# Altium schematic sheet Power_official.SchDoc
size A4; Organization: Altium Limited; Address1: L3, 12a Rodborough Rd; Address2: Frenchs Forest; Address3: NSW; Address4: Australia 2086
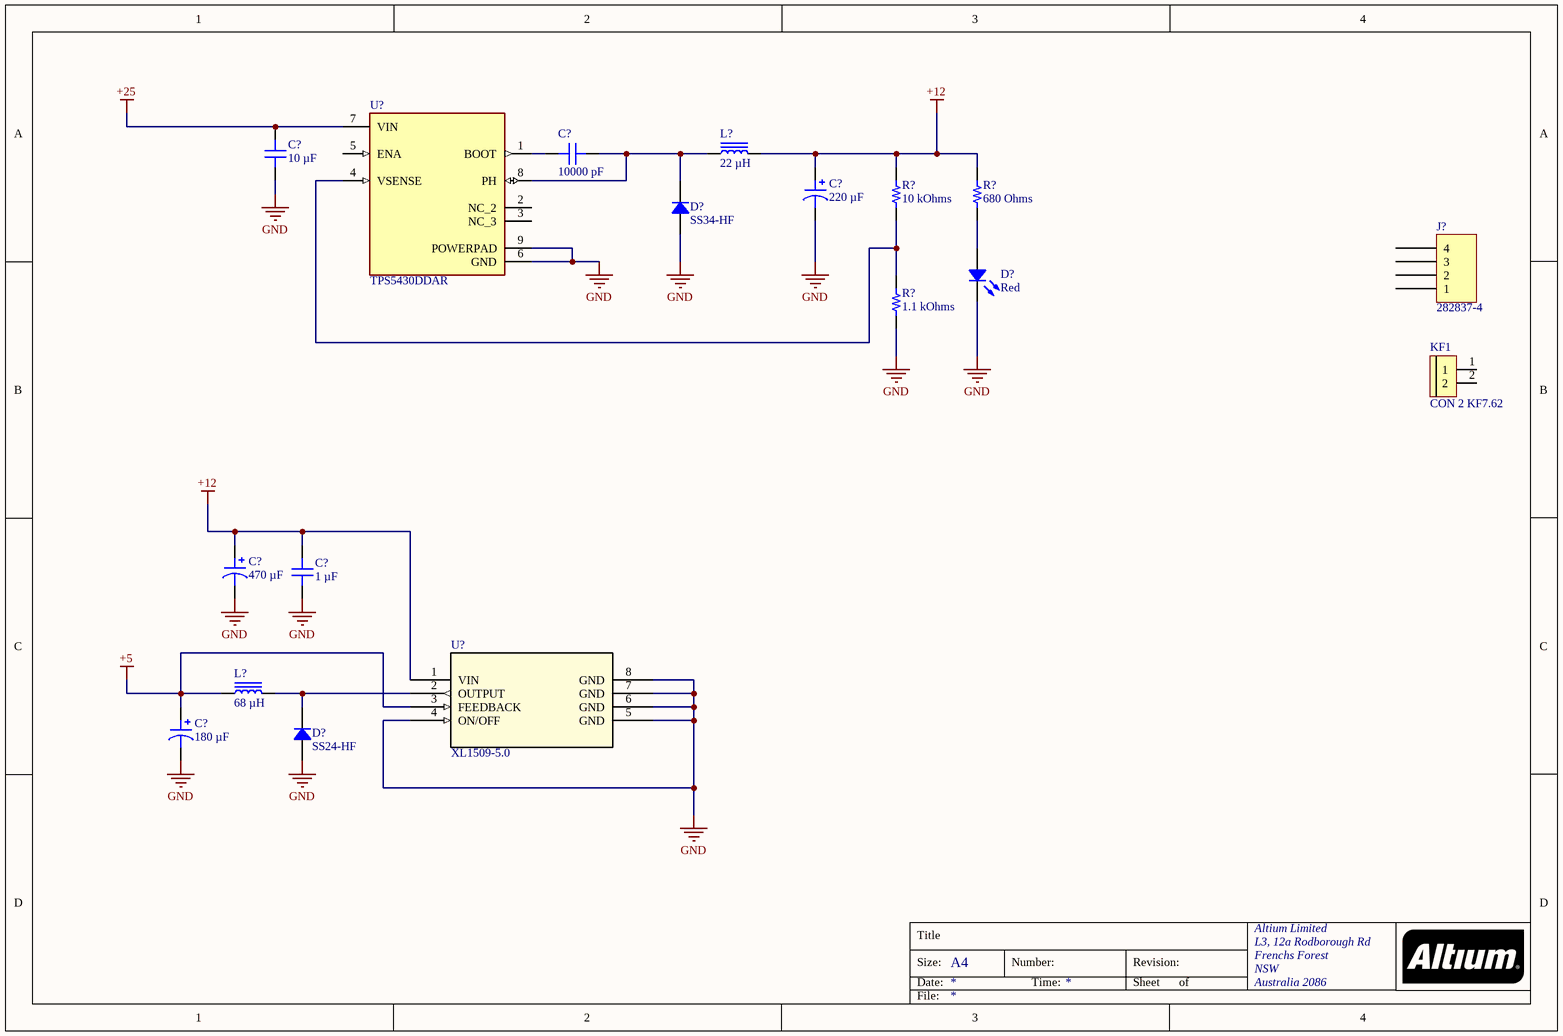
[diagram p0: Power_official.SchDoc]

## Parts
(Parts that share a designator on the sheet are numbered #1, #2 ... from top to bottom, then left to right.)
C?#1  10 µF  [CAP 1206_3216 - 0.8MM]
C?#2  10000 pF  [CAP 0603_1608]
C?#3  220 µF  [CAP ALSMD 6.6MM H6.1MM]
C?#4  470 µF  [CAP ALSMD 8.3MM H10.5MM]
C?#5  1 µF  [CAP 0805_2012]
C?#6  180 µF  [CAP ALSMD 6.6MM H8.0MM]
D?#1  SS34-HF  [DO214AC SMA]
D?#2  Red  [LED 0805_2012 RED]
D?#3  SS24-HF  [DO214AC SMA]
J?  282837-4  [TE 282837-4]
KF1  CON 2 KF7.62  [CON 2 KF7.62]
L?#1  22 µH  [WURTH WE-PD 1260]
L?#2  68 µH  [TDK SLF10145]
R?#1  10 kOhms  [RES 0805_2012]
R?#2  680 Ohms  [RES 0805_2012]
R?#3  1.1 kOhms  [RES 0805_2012]
U?#1  TPS5430DDAR  [CONV_TPS5430DDAR]
U?#2  XL1509-5.0  [SOP8SOIC-8_UMW]

## Nets
+5: C?#6.1 L?#2.1 U?#2.3(FEEDBACK)
+12: C?#3.1 C?#4.1 C?#5.2 L?#1.2 R?#1.2 R?#2.2 U?#2.1(VIN)
+25: C?#1.2 U?#1.7(VIN)
GND: C?#1.1 C?#3.2 C?#4.2 C?#5.1 C?#6.2 D?#1.1 D?#2.2 D?#3.1 R?#3.1 U?#1.6(GND) U?#1.9(POWERPAD) U?#2.4(ON/OFF) U?#2.5(GND) U?#2.6(GND) U?#2.7(GND) U?#2.8(GND)
NetC?#2_1: C?#2.1 U?#1.1(BOOT)
NetC?#2_2: C?#2.2 D?#1.2 L?#1.1 U?#1.8(PH)
NetD?#2_1: D?#2.1 R?#2.1
NetD?#3_2: D?#3.2 L?#2.2 U?#2.2(OUTPUT)
NetR?#1_1: R?#1.1 R?#3.2 U?#1.4(VSENSE)

Not connected (* = marked no-connect by the designer): J? 1 2 3 4; KF1 1 2; U?#1 2(NC_2) 3(NC_3) 5(ENA)

## Notes on the sheet
- Title
- Size:
- Date:
- A4
- Number:
- Time:
- Revision:
- Sheet
- of
- File:

## Library data of the parts
C?#1 = 885012108022: CAP CER 10UF 50V X5R 1206; manufacturer: Würth Elektronik; Tolerance: ±10%; Part Number: 885012108022; Value: 10 µF; Applications: General Purpose; Capacitance: 10 µF; componentlink1description: Datasheet; componentlink1url: https://www.we-online.com/catalog/datasheet/885012108022.pdf; componentlink2description: DigiKey Link; componentlink2url: https://www.digikey.com/en/products/detail/würth-elektronik/885012108022/17829827; Device Package: 1206 (3216 Metric); lastupdated: 6/4/2024 7:10:08 PM; Lifecycle Status: Active; Minimum Order: 1; Mounting Type: Surface Mount, MLCC; Operating Temperature: -55°C ~ 85°C; Package / Case: 1206 (3216 Metric); packaging: TapeAndReel; partid: 49462; Part Status: Active; price: 1.51; series: WCAP-CSGP; Size / Dimension: 0.126" L x 0.063" W (3.20mm x 1.60mm); Supplier 1: DigiKey; Supplier Part Number 1: 732-885012108022CT-ND; Temperature Coefficient: X5R; Thickness (Max): 0.071" (1.80mm); Voltage - Rated: 50V
C?#2 = C0603C103K4REC7867: CAP CER 0603 10NF 16V X7R 10%; manufacturer: KEMET; Part Number: C0603C103K4REC7867; Value: 10000 pF; Applications: ESD Protection; Capacitance: 10000 pF; componentlink1description: Datasheet; componentlink1url: https://api.kemet.com/component-edge/download/datasheet/C0603C103K4REC7867.pdf; componentlink2description: DigiKey Link; componentlink2url: https://www.digikey.com/en/products/detail/kemet/C0603C103K4REC7867/8643658; Device Package: 0603 (1608 Metric); lastupdated: 2/9/2024 8:09:56 PM; Lifecycle Status: Active; Minimum Order: 1; Mounting Type: Surface Mount, MLCC; Operating Temperature: -55°C ~ 125°C; Package / Case: 0603 (1608 Metric); packaging: TapeAndReel; partid: 34998; Part Status: Active; price: 0.01; series: ESD SMD Comm X7R; Size / Dimension: 0.063" L x 0.031" W (1.60mm x 0.80mm); Supplier 1: DigiKey; Supplier Part Number 1: 399-C0603C103K4REC7867CT-ND; Temperature Coefficient: X7R; Thickness (Max): 0.034" (0.87mm); Tolerance: ±10%; Voltage - Rated: 16V
C?#3 = EEE-FT1C221AL: CAP ALUM 220UF 20% 16V SMD; manufacturer: Panasonic Electronic Components; ESR (Equivalent Series Resistance): 260mOhm @ 100kHz; Lifetime @ Temp.: 2000 Hrs @ 105°C; Polarization: Polar; Ripple Current @ High Frequency: 300 mA @ 100 kHz; Ripple Current @ Low Frequency: 195 mA @ 120 Hz; Surface Mount Land Size: 0.260" L x 0.260" W (6.60mm x 6.60mm); Part Number: EEE-FT1C221AL; Applications: Automotive; Capacitance: 220 µF; componentlink1description: Datasheet; componentlink1url: https://na.industrial.panasonic.com/file-download/19625; componentlink2description: DigiKey Link; componentlink2url: https://www.digikey.com/en/products/detail/panasonic-electronic-components/EEE-FT1C221AL/12459640; Height - Seated (Max): 0.240" (6.10mm); lastupdated: 6/3/2024 8:16:06 PM; Lifecycle Status: Active; Minimum Order: 1; Mounting Type: Surface Mount; Operating Temperature: -55°C ~ 105°C; packaging: TapeAndReel; partid: 28448; price: 0.16; Ratings: AEC-Q200; series: FT, Halogen Free; Size / Dimension: 0.248" Dia (6.30mm); Supplier 1: DigiKey; Supplier Part Number 1: 10-EEE-FT1C221ALCT-ND; Tolerance: ±20%; value: 220 µF; Voltage - Rated: 16 V
C?#4 = EMZS350ARA471MHA0G: CAP ALUM 470UF 20% 35V SMD; manufacturer: United Chemi-Con; ESR (Equivalent Series Resistance): 80mOhm @ 100kHz; Lifetime @ Temp.: 2000 Hrs @ 105°C; Polarization: Polar; Ripple Current @ High Frequency: 850 mA @ 100 kHz; Ripple Current @ Low Frequency: 425 mA @ 120 Hz; Surface Mount Land Size: 0.327" L x 0.327" W (8.30mm x 8.30mm); Part Number: EMZS350ARA471MHA0G; Applications: Automotive; Capacitance: 470 µF; componentlink1description: Datasheet; componentlink1url: //media.digikey.com/pdf/Data%20Sheets/United%20Chemi-Con%20PDFs/MZS_Series_NPI.pdf; componentlink2description: DigiKey Link; componentlink2url: https://www.digikey.com/en/products/detail/united-chemi-con/EMZS350ARA471MHA0G/8637079; Device Package: Radial, Can - SMD; Height - Seated (Max): 0.413" (10.50mm); lastupdated: 6/3/2024 8:15:48 PM; Lifecycle Status: Active; Minimum Order: 1; Mounting Type: Surface Mount; Operating Temperature: -55°C ~ 105°C; Package / Case: Radial, Can - SMD; packaging: TapeAndReel; partid: 7526; Part Status: Active; price: 0.40; Ratings: AEC-Q200; series: Alchip™- MZS; Size / Dimension: 0.315" Dia (8.00mm); Supplier 1: DigiKey; Supplier Part Number 1: 565-5123-1-ND; Tolerance: ±20%; value: 470 µF; Voltage - Rated: 35 V
C?#5 = C0805C105J4RECAUTO: CAP CER 0805 1UF 16V X7R 5%; manufacturer: KEMET; Part Number: C0805C105J4RECAUTO; Value: 1 µF; Applications: Automotive, ESD Protection; Capacitance: 1 µF; componentlink1description: Datasheet; componentlink1url: https://api.kemet.com/component-edge/download/datasheet/C0805C105J4RECAUTO.pdf; componentlink2description: DigiKey Link; componentlink2url: https://www.digikey.com/en/products/detail/kemet/C0805C105J4RECAUTO/8646570; Device Package: 0805 (2012 Metric); lastupdated: 2/9/2024 8:15:08 PM; Lifecycle Status: Active; Minimum Order: 1; Mounting Type: Surface Mount, MLCC; Operating Temperature: -55°C ~ 125°C; Package / Case: 0805 (2012 Metric); packaging: TapeAndReel; partid: 32406; Part Status: Active; price: 0.05; Ratings: AEC-Q200; series: ESD SMD Auto X7R; Size / Dimension: 0.079" L x 0.049" W (2.00mm x 1.25mm); Supplier 1: DigiKey; Supplier Part Number 1: 399-C0805C105J4RECAUTOCT-ND; Temperature Coefficient: X7R; Thickness (Max): 0.055" (1.40mm); Tolerance: ±5%; Voltage - Rated: 16V
C?#6 = EEE-FKE181XSP: CAP ALUM 180UF 20% 25V SMD; manufacturer: Panasonic Electronic Components; ESR (Equivalent Series Resistance): 340mOhm @ 100kHz; Lifetime @ Temp.: 2000 Hrs @ 105°C; Polarization: Polar; Ripple Current @ High Frequency: 280 mA @ 100 kHz; Ripple Current @ Low Frequency: 182 mA @ 120 Hz; Surface Mount Land Size: 0.260" L x 0.260" W (6.60mm x 6.60mm); Part Number: EEE-FKE181XSP; Applications: Automotive; Capacitance: 180 µF; componentlink1description: Datasheet; componentlink1url: https://b2b-api.panasonic.eu/file_stream/pids/fileversion/3102; componentlink2description: DigiKey Link; componentlink2url: https://www.digikey.com/en/products/detail/panasonic-electronic-components/EEE-FKE181XSP/5805038; Device Package: Radial, Can - SMD; Height - Seated (Max): 0.315" (8.00mm); lastupdated: 6/3/2024 8:16:27 PM; Lifecycle Status: Active; Minimum Order: 1; Mounting Type: Surface Mount; Operating Temperature: -55°C ~ 105°C; Package / Case: Radial, Can - SMD; packaging: TapeAndReel; partid: 27654; Part Status: Active; price: 0.22; Ratings: AEC-Q200; series: FKS; Size / Dimension: 0.248" Dia (6.30mm); Supplier 1: DigiKey; Supplier Part Number 1: P18956CT-ND; Tolerance: ±20%; value: 180 µF; Voltage - Rated: 25 V
D?#1 = SS34-HF: DIODE SCHOTTKY 40V 3A DO214AC; Manufacturer: Comchip Technology; Capacitance @ Vr, F: 450pF @ 4V, 1MHz; Current - Reverse Leakage @ Vr: 500 µA @ 40 V; Speed: Fast Recovery =< 500ns, > 200mA (Io); Voltage - Forward (Vf) (Max) @ If: 550 mV @ 3 A; Part Number: SS34-HF; ComponentLink1Description: Datasheet; ComponentLink1URL: http://www.comchiptech.com/admin/files/product/20190514101641.pdf; ComponentLink2Description: DigiKey Link; ComponentLink2URL: https://www.digikey.com/en/products/detail/comchip-technology/SS34-HF/10279693; Current - Average Rectified (Io): 3A; Diode Type: Schottky; LastUpdated: 6/3/2024 7:54:30 PM; Lifecycle Status: Active; Minimum Order: 1; Mounting Type: Surface Mount; Operating Temperature - Junction: -55°C ~ 125°C; Package / Case: DO-214AC, SMA; Packaging: TapeAndReel; PartId: 2138; Part Status: Active; Price: 0.07; Series: -; Supplier 1: DigiKey; Supplier Part Number 1: 641-2115-1-ND; Supplier Device Package: DO-214AC (SMA); Voltage - DC Reverse (Vr) (Max): 40 V
D?#2 = B1701URO-20D000114U1930: LED RED DIFFUSED 0805 SMD; Manufacturer: Harvatek Corporation; Current - Test: 20mA; Lens Size: 1.40mm x 1.30mm; Lens Style: Rectangle with Flat Top; Millicandela Rating: 71.5mcd; Viewing Angle: 130°; Voltage - Forward (Vf) (Typ): 2V; Wavelength - Dominant: 631nm; Wavelength - Peak: 639nm; Part Number: B1701URO-20D000114U1930; Color: Red; ComponentLink1Description: Datasheet; ComponentLink1URL: https://media.digikey.com/pdf/Data%20Sheets/Harvatek%20PDFs/B1701URO-20D000114U1930.pdf; ComponentLink2Description: DigiKey Link; ComponentLink2URL: https://www.digikey.com/en/products/detail/harvatek-corporation/B1701URO-20D000114U1930/16671739; Device Package: 0805 (2012 Metric); Height (Max): 0.90mm; LastUpdated: 6/3/2024 8:00:05 PM; Lens Transparency: Diffused; Lifecycle Status: Active; Minimum Order: 1; Mounting Type: Surface Mount; Package / Case: 0805 (2012 Metric); Packaging: TapeAndReel; PartId: 1175; Part Status: Active; Price: 0.09; Series: B1701URO; Size / Dimension: 2.00mm L x 1.30mm W; Supplier 1: DigiKey; Supplier Part Number 1: 3147-B1701URO-20D000114U1930CT-ND; Supplier Device Package: 0805; Value: Red
D?#3 = SS24-HF: DIODE SCHOTTKY 40V 2A DO214AC; Manufacturer: Comchip Technology; Capacitance @ Vr, F: 220pF @ 4V, 1MHz; Current - Reverse Leakage @ Vr: 500 µA @ 40 V; Speed: Fast Recovery =< 500ns, > 200mA (Io); Voltage - Forward (Vf) (Max) @ If: 550 mV @ 2 A; Part Number: SS24-HF; ComponentLink1Description: Datasheet; ComponentLink1URL: http://www.comchiptech.com/admin/files/product/20190621155523.PDF; ComponentLink2Description: DigiKey Link; ComponentLink2URL: https://www.digikey.com/en/products/detail/comchip-technology/SS24-HF/10443640; Current - Average Rectified (Io): 2A; Diode Type: Schottky; LastUpdated: 6/3/2024 7:54:32 PM; Lifecycle Status: Active; Minimum Order: 1; Mounting Type: Surface Mount; Operating Temperature - Junction: -55°C ~ 150°C; Package / Case: DO-214AC, SMA; Packaging: TapeAndReel; PartId: 2029; Part Status: Active; Price: 0.05; Series: -; Supplier 1: DigiKey; Supplier Part Number 1: 641-SS24-HFCT-ND; Supplier Device Package: DO-214AC (SMA); Voltage - DC Reverse (Vr) (Max): 40 V
J? = 282837-4: TERM BLK 4P SIDE ENT 5.08MM PCB; Manufacturer: TE Connectivity AMP Connectors; Current: 13.5 A; Mating Orientation: Horizontal with Board; Number of Levels: 1; Pitch: 0.200" (5.08mm); Positions Per Level: 4; Voltage: 300 V; Wire Gauge: 16-28 AWG; Wire Termination: Screw - Rising Cage Clamp; Part Number: 282837-4; Color: Green; ComponentLink1Description: Datasheet; ComponentLink1URL: https://www.te.com/commerce/DocumentDelivery/DDEController?Action=srchrtrv&DocNm=282837&DocType=Customer+Drawing&DocLang=English; ComponentLink2Description: DigiKey Link; ComponentLink2URL: https://www.digikey.com/en/products/detail/te-connectivity-amp-connectors/282837-4/2187975; Features: Interlocking (Side); LastUpdated: 6/21/2022 3:00:53 PM; Lifecycle Status: Active; Minimum Order: 1; Mounting Type: Through Hole; Packaging: Tray; Part Status: Active; Price: 0.62; Series: Buchanan; Supplier 1: DigiKey; Supplier Part Number 1: A124423-ND
KF1 = CON 2 KF7.62: Cắm; Ma_Hang: MH002053; Ten_Linh_Kien: CON 2 KF7.62-2P 7.62MM (Đen Thẳng); Chung_Loai: Cắm; Ghi_Chu: *; Kieu_Chan: *; Don_Vi: Con
L?#1 = 744771122: FIXED IND 22UH 3.37A 36 MOHM SMD; Manufacturer: Würth Elektronik; Current - Saturation: 3.77A; DC Resistance (DCR): 36mOhm Max; Frequency - Self Resonant: 13.5MHz; Inductance Frequency - Test: 1 kHz; Material - Core: Ferrite; Shielding: Shielded; Tolerance: ±20%; Type: Drum Core, Wirewound; Part Number: 744771122; ComponentLink1Description: Datasheet; ComponentLink1URL: https://katalog.we-online.de/pbs/datasheet/744771122.pdf; ComponentLink2Description: DigiKey Link; ComponentLink2URL: https://www.digikey.com/en/products/detail/würth-elektronik/744771122/1638616; Current Rating (Amps): 3.37 A; Device Package: Nonstandard; Height - Seated (Max): 0.236" (6.00mm); Inductance: 22 µH; LastUpdated: 6/3/2024 8:26:19 PM; Lifecycle Status: Active; Minimum Order: 1; Mounting Type: Surface Mount; Operating Temperature: -40°C ~ 125°C; Package / Case: Nonstandard; Packaging: TapeAndReel; PartId: 5724; Part Status: Active; Price: 1.18; Ratings: AEC-Q200; Series: WE-PD; Size / Dimension: 0.472" L x 0.472" W (12.00mm x 12.00mm); Supplier 1: DigiKey; Supplier Part Number 1: 732-1211-1-ND; Value: 22 µH
L?#2 = SLF10145T-680M1R2-PF: FIXED IND 68UH 1.3A 168 MOHM SMD; Manufacturer: TDK Corporation; Current - Saturation: 1.2A; DC Resistance (DCR): 168mOhm Max; Inductance Frequency - Test: 1 kHz; Material - Core: Ferrite; Shielding: Shielded; Tolerance: ±20%; Type: Drum Core, Wirewound; Part Number: SLF10145T-680M1R2-PF; ComponentLink1Description: Datasheet; ComponentLink1URL: https://product.tdk.com/info/en/catalog/datasheets/inductor_commercial_power_slf10145_en.pdf?ref_disty=digikey; ComponentLink2Description: DigiKey Link; ComponentLink2URL: https://www.digikey.com/en/products/detail/tdk-corporation/SLF10145T-680M1R2-PF/755339; Current Rating (Amps): 1.3 A; Device Package: Nonstandard; Height - Seated (Max): 0.189" (4.80mm); Inductance: 68 µH; LastUpdated: 7/12/2023 8:19:31 PM; Lifecycle Status: Active; Minimum Order: 1; Mounting Type: Surface Mount; Operating Temperature: -40°C ~ 105°C; Package / Case: Nonstandard; Packaging: TapeAndReel; PartId: 81; Part Status: Active; Price: 0.44; Series: SLF; Size / Dimension: 0.398" L x 0.398" W (10.10mm x 10.10mm); Supplier 1: DigiKey; Supplier Part Number 1: 445-1987-1-ND; Value: 68 µH
R?#1 = ERJ-UP6J103V: RES 10K OHM 5% 1/2W 0805; Manufacturer: Panasonic Electronic Components; Power (Watts): 0.5W, 1/2W; Temperature Coefficient: ±200ppm/°C; Part Number: ERJ-UP6J103V; Value: 10 kOhms; ComponentLink1Description: Datasheet; ComponentLink1URL: https://api.pim.na.industrial.panasonic.com/file_stream/main/fileversion/4484; ComponentLink2Description: DigiKey Link; ComponentLink2URL: https://www.digikey.com/en/products/detail/panasonic-electronic-components/ERJ-UP6J103V/8134737; Composition: Thick Film; Device Package: 0805 (2012 Metric); Features: Anti-Sulfur, Automotive AEC-Q200, Pulse Withstanding; Height - Seated (Max): 0.028" (0.70mm); LastUpdated: 2/8/2024 9:00:07 PM; Lifecycle Status: Active; Minimum Order: 1; Number of Terminations: 2; Operating Temperature: -55°C ~ 155°C; Package / Case: 0805 (2012 Metric); Packaging: TapeAndReel; PartId: 76882; Part Status: Active; Price: 0.02; Ratings: AEC-Q200; Resistance: 10 kOhms; Series: ERJ-UP6; Size / Dimension: 0.079" L x 0.049" W (2.00mm x 1.25mm); Supplier 1: DigiKey; Supplier Part Number 1: 10-ERJ-UP6J103VCT-ND; Supplier Device Package: 0805; Tolerance: ±5%
R?#2 = ERA-6AEB681V: RES SMD 680 OHM 0.1% 1/8W 0805; Manufacturer: Panasonic Electronic Components; Power (Watts): 0.125W, 1/8W; Temperature Coefficient: ±25ppm/°C; Part Number: ERA-6AEB681V; Value: 680 Ohms; ComponentLink1Description: Datasheet; ComponentLink1URL: https://industrial.panasonic.com/cdbs/www-data/pdf/RDM0000/AOA0000C307.pdf; ComponentLink2Description: DigiKey Link; ComponentLink2URL: https://www.digikey.com/en/products/detail/panasonic-electronic-components/ERA-6AEB681V/1465744; Composition: Thin Film; Device Package: 0805 (2012 Metric); Features: Automotive AEC-Q200; Height - Seated (Max): 0.024" (0.60mm); LastUpdated: 2/8/2024 9:00:55 PM; Lifecycle Status: Active; Minimum Order: 1; Number of Terminations: 2; Operating Temperature: -55°C ~ 155°C; Package / Case: 0805 (2012 Metric); Packaging: TapeAndReel; PartId: 48903; Part Status: Active; Price: 0.03; Ratings: AEC-Q200; Resistance: 680 Ohms; Series: ERA-6A; Size / Dimension: 0.079" L x 0.049" W (2.00mm x 1.25mm); Supplier 1: DigiKey; Supplier Part Number 1: P680DACT-ND; Supplier Device Package: 0805; Tolerance: ±0.1%
R?#3 = ERA-6APB112V: RES SMD 1.1K OHM 0.1% 1/8W 0805; Manufacturer: Panasonic Electronic Components; Power (Watts): 0.125W, 1/8W; Temperature Coefficient: ±15ppm/°C; Part Number: ERA-6APB112V; Value: 1.1 kOhms; ComponentLink1Description: Datasheet; ComponentLink1URL: https://industrial.panasonic.com/cdbs/www-data/pdf/RDM0000/AOA0000C307.pdf; ComponentLink2Description: DigiKey Link; ComponentLink2URL: https://www.digikey.com/en/products/detail/panasonic-electronic-components/ERA-6APB112V/3070681; Composition: Thin Film; Device Package: 0805 (2012 Metric); Features: Automotive AEC-Q200; Height - Seated (Max): 0.024" (0.60mm); LastUpdated: 2/8/2024 9:02:01 PM; Lifecycle Status: Active; Minimum Order: 1; Number of Terminations: 2; Operating Temperature: -55°C ~ 155°C; Package / Case: 0805 (2012 Metric); Packaging: TapeAndReel; PartId: 36576; Part Status: Active; Price: 0.15; Ratings: AEC-Q200; Resistance: 1.1 kOhms; Series: ERA-6A; Size / Dimension: 0.079" L x 0.049" W (2.00mm x 1.25mm); Supplier 1: DigiKey; Supplier Part Number 1: P1.1KAZCT-ND; Supplier Device Package: 0805; Tolerance: ±0.1%
U?#1 = TPS5430DDAR: 5.5V to 36V Input, 3A, 500kHz Step-Down Converter; MF: Texas Instruments; Package: HSOIC-8 Texas Instruments; Check_prices: https://www.snapeda.com/parts/TPS5430DDAR/Texas+Instruments/view-part/?ref=eda; Value: *; Purchase-URL: https://pricing.snapeda.com/search/part/TPS5430DDAR/?ref=eda; Availability: In Stock; SnapEDA_Link: https://www.snapeda.com/parts/TPS5430DDAR/Texas+Instruments/view-part/?ref=snap; MP: TPS5430DDAR; Price: None
U?#2 = XL1509-5.0: No Description Available; Mfr_Name: UMW(Youtai Semiconductor Co., Ltd.); RefDes: RefDes; Type: Type